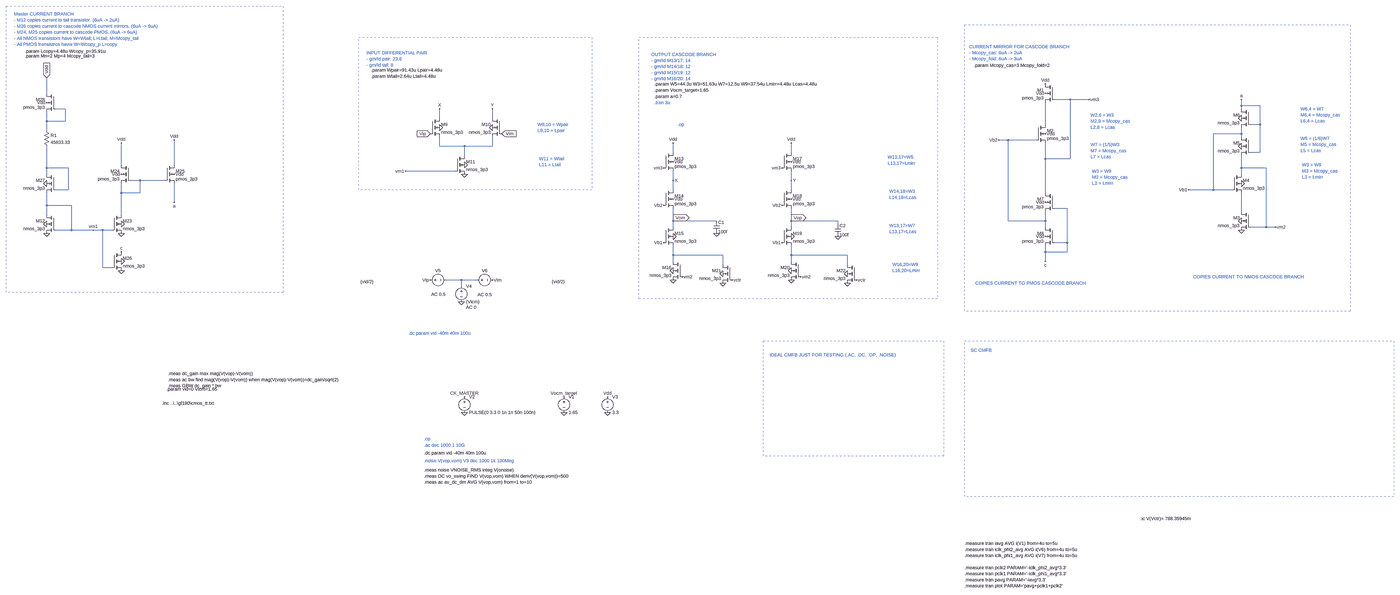
[diagram p0: schematic Draft15.asc, whole sheet]
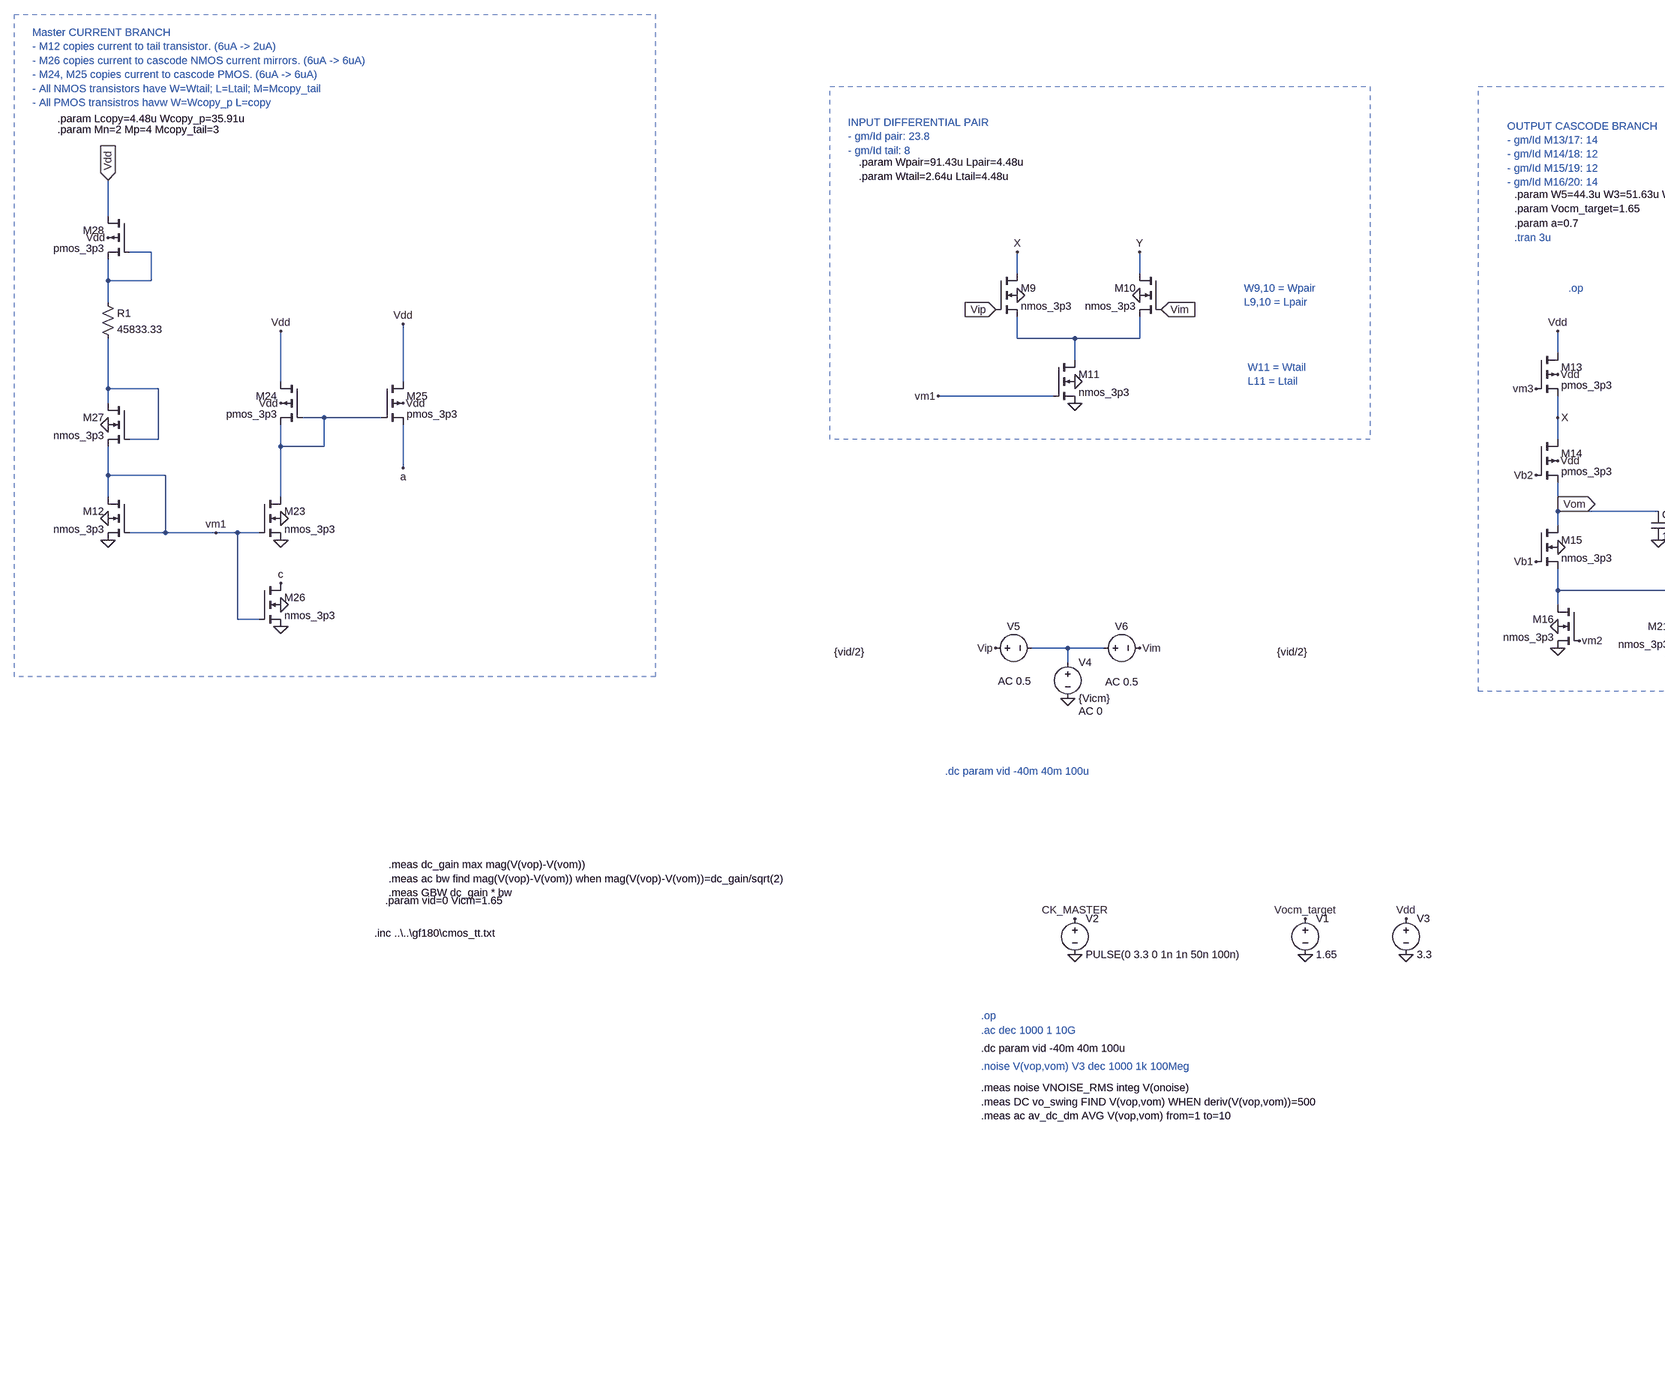
[diagram p1: schematic Draft15.asc, part, row 1 of 1, column 1 of 2]
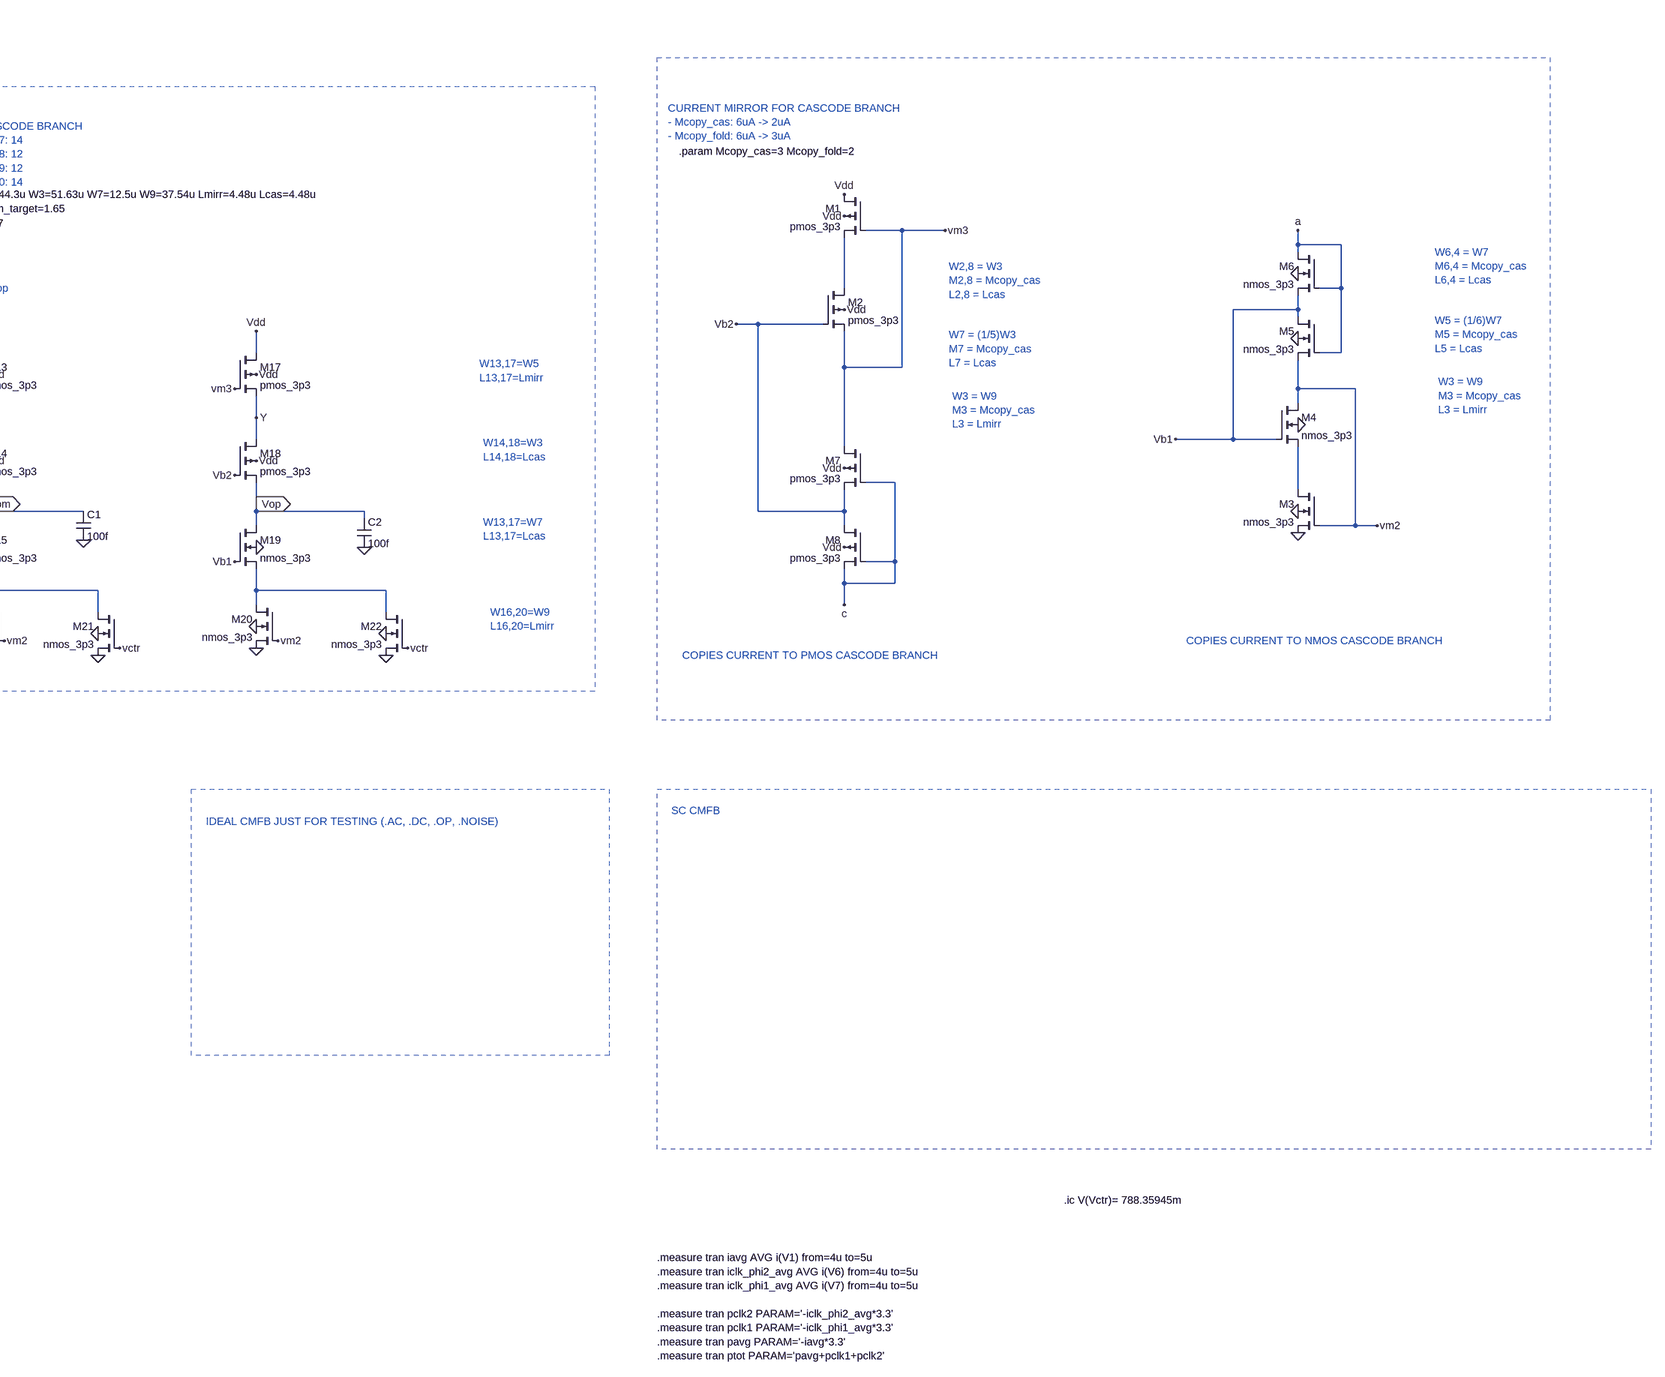
[diagram p2: schematic Draft15.asc, part, row 1 of 1, column 2 of 2]
Draft15.asc, the LTspice schematic file:
Version 4
SHEET 1 3844 1892
WIRE -3600 -688 -3600 -768
WIRE 2176 -656 2096 -656
WIRE 2272 -656 2176 -656
WIRE 3056 -624 3056 -656
WIRE 3152 -624 3056 -624
WIRE -3504 -608 -3552 -608
WIRE 3056 -608 3056 -624
WIRE -1536 -560 -1536 -608
WIRE -1264 -560 -1264 -608
WIRE -3600 -544 -3600 -592
WIRE -3504 -544 -3504 -608
WIRE -3504 -544 -3600 -544
WIRE 2048 -528 2048 -640
WIRE 3152 -528 3152 -624
WIRE 3152 -528 3104 -528
WIRE -3600 -496 -3600 -544
WIRE 3056 -480 3056 -512
WIRE 3056 -480 2912 -480
WIRE 3056 -464 3056 -480
WIRE 1856 -448 1808 -448
WIRE 2000 -448 1856 -448
WIRE -1536 -416 -1536 -464
WIRE -1408 -416 -1536 -416
WIRE -1264 -416 -1264 -464
WIRE -1264 -416 -1408 -416
WIRE -320 -384 -320 -432
WIRE 288 -384 288 -432
WIRE 3152 -384 3152 -528
WIRE 3152 -384 3104 -384
WIRE -1408 -368 -1408 -416
WIRE 2048 -352 2048 -432
WIRE 2176 -352 2176 -656
WIRE 2176 -352 2048 -352
WIRE -3216 -320 -3216 -432
WIRE -2944 -320 -2944 -448
WIRE -3600 -304 -3600 -416
WIRE -3488 -304 -3600 -304
WIRE 3056 -304 3056 -368
WIRE 3184 -304 3056 -304
WIRE -1456 -288 -1712 -288
WIRE -3600 -272 -3600 -304
WIRE 3056 -272 3056 -304
WIRE -3120 -240 -3168 -240
WIRE -2992 -240 -3120 -240
WIRE -320 -240 -320 -288
WIRE 288 -240 288 -288
WIRE -3488 -192 -3488 -304
WIRE -3488 -192 -3552 -192
WIRE -320 -192 -320 -240
WIRE 288 -192 288 -240
WIRE 2912 -192 2912 -480
WIRE 2912 -192 2784 -192
WIRE 3008 -192 2912 -192
WIRE -3216 -176 -3216 -224
WIRE -3120 -176 -3120 -240
WIRE -3120 -176 -3216 -176
WIRE 2048 -176 2048 -352
WIRE -2944 -128 -2944 -224
WIRE -3600 -112 -3600 -176
WIRE -3472 -112 -3600 -112
WIRE 2160 -96 2096 -96
WIRE 3056 -80 3056 -176
WIRE -3600 -64 -3600 -112
WIRE -3216 -64 -3216 -176
WIRE -320 -48 -320 -96
WIRE 288 -48 288 -96
WIRE -320 -32 -320 -48
WIRE -96 -32 -320 -32
WIRE 288 -32 288 -48
WIRE 528 -32 288 -32
WIRE 1856 -32 1856 -448
WIRE 2048 -32 2048 -80
WIRE 2048 -32 1856 -32
WIRE 528 -16 528 -32
WIRE -320 0 -320 -32
WIRE 288 0 288 -32
WIRE 2048 0 2048 -32
WIRE 3184 0 3184 -304
WIRE 3184 0 3104 0
WIRE 3232 0 3184 0
WIRE -3472 16 -3472 -112
WIRE -3472 16 -3552 16
WIRE -3360 16 -3472 16
WIRE -3312 16 -3360 16
WIRE -3264 16 -3312 16
WIRE 2160 80 2160 -96
WIRE 2160 80 2096 80
WIRE 2048 128 2048 96
WIRE 2160 128 2160 80
WIRE 2160 128 2048 128
WIRE -320 144 -320 96
WIRE -64 144 -320 144
WIRE 288 144 288 96
WIRE 576 144 288 144
WIRE -320 176 -320 144
WIRE 288 176 288 144
WIRE 2048 176 2048 128
WIRE -64 192 -64 144
WIRE 576 192 576 144
WIRE -3312 208 -3312 16
WIRE -3264 208 -3312 208
WIRE -1424 272 -1504 272
WIRE -1344 272 -1424 272
WIRE -1424 304 -1424 272
FLAG 2048 -688 Vdd
FLAG 2048 -736 Vdd
FLAG 2048 -480 Vdd
FLAG 2272 -656 vm3
FLAG 1808 -448 Vb2
FLAG 2048 176 c
FLAG 3056 16 0
FLAG 3056 -32 0
FLAG 3232 0 vm2
FLAG 3056 -224 0
FLAG 2784 -192 Vb1
FLAG 3056 -656 a
FLAG 3056 -416 0
FLAG 3056 -560 0
FLAG 2048 -128 Vdd
FLAG 2048 48 Vdd
FLAG -1408 -272 0
FLAG -1536 -512 0
FLAG -1264 -512 0
FLAG -1408 -320 0
FLAG -3600 32 0
FLAG -3600 -16 0
FLAG -1584 -480 Vip
IOPIN -1584 -480 In
FLAG -1216 -480 Vim
IOPIN -1216 -480 In
FLAG -320 -432 Vdd
FLAG -320 272 0
FLAG -320 224 0
FLAG -320 48 0
FLAG -320 -240 X
FLAG -320 -144 Vdd
FLAG -368 80 Vb1
FLAG -368 -112 Vb2
FLAG -320 -336 Vdd
FLAG 288 -432 Vdd
FLAG 288 272 0
FLAG 288 224 0
FLAG 288 48 0
FLAG 288 -240 Y
FLAG 288 -144 Vdd
FLAG 240 80 Vb1
FLAG 240 -112 Vb2
FLAG 288 -336 Vdd
FLAG 336 256 vm2
FLAG -272 256 vm2
FLAG 240 -304 vm3
FLAG -368 -304 vm3
FLAG 288 -48 Vop
IOPIN 288 -48 Out
FLAG -320 -48 Vom
IOPIN -320 -48 Out
FLAG -1536 -608 X
FLAG -1264 -608 Y
FLAG -3360 16 vm1
FLAG -64 288 0
FLAG -64 240 0
FLAG -16 272 vctr
FLAG 576 288 0
FLAG 576 240 0
FLAG 624 272 vctr
FLAG -96 32 0
FLAG 528 48 0
FLAG -1712 -288 vm1
FLAG -3216 32 0
FLAG -3216 -16 0
FLAG -3216 -272 Vdd
FLAG -3216 -432 Vdd
FLAG -2944 -272 Vdd
FLAG -2944 -448 Vdd
FLAG -2944 -128 a
FLAG -3216 224 0
FLAG -3216 176 0
FLAG -3216 128 c
FLAG -3600 -768 Vdd
IOPIN -3600 -768 In
FLAG -3600 -224 0
FLAG -3600 -640 Vdd
FLAG -896 960 0
FLAG -1408 960 0
FLAG -1408 880 CK_MASTER
FLAG -672 960 0
FLAG -672 880 Vdd
FLAG -1424 384 0
FLAG -1584 272 Vip
FLAG -1264 272 Vim
FLAG -896 880 Vocm_target
DATAFLAG -1552 -288 ""
DATAFLAG 1904 -448 ""
DATAFLAG 2160 -656 ""
DATAFLAG 2864 -192 ""
DATAFLAG 3168 0 ""
DATAFLAG -224 -32 ""
DATAFLAG -1392 -416 ""
DATAFLAG -160 144 ""
DATAFLAG 160 -16 "Id(M18)"
DATAFLAG 144 -336 "Id(M17)"
DATAFLAG -1248 -320 "Id(M11)"
DATAFLAG -1664 -592 "Id(M9)"
DATAFLAG -1168 -608 "Id(M9)"
DATAFLAG -240 -224 "V(X)"
DATAFLAG 160 176 "Id(M20)"
DATAFLAG 688 176 "Id(M22)"
DATAFLAG -3472 -32 ""
DATAFLAG -2944 -160 "Id(M25)"
DATAFLAG -3216 96 "Id(M26)"
DATAFLAG 3056 -688 "Id(M6)"
DATAFLAG 2048 224 "Id(M6)"
DATAFLAG -240 256 ""
SYMBOL pmos4 2096 -736 M0
SYMATTR InstName M1
SYMATTR Value pmos_3p3
SYMATTR Value2 l='Lmirr' w='W5' m=Mcopy_fold
SYMBOL pmos4 2000 -528 R0
SYMATTR InstName M2
SYMATTR Value pmos_3p3
SYMATTR Value2 l='Lcas' w='W3' m=Mcopy_cas
SYMBOL nmos4 3104 -80 M0
SYMATTR InstName M3
SYMATTR Value nmos_3p3
SYMATTR Value2 l='Lmirr' w='W9' m=Mcopy_cas
SYMBOL nmos4 3008 -272 R0
SYMATTR InstName M4
SYMATTR Value nmos_3p3
SYMATTR Value2 l='Lcas' w='W7' m=Mcopy_cas
SYMBOL nmos4 3104 -464 M0
SYMATTR InstName M5
SYMATTR Value nmos_3p3
SYMATTR Value2 l='Lcas' w='(1/6)*W7' m=Mcopy_cas
SYMBOL nmos4 3104 -608 M0
SYMATTR InstName M6
SYMATTR Value nmos_3p3
SYMATTR Value2 l='Lcas' w='W7' m=Mcopy_cas
SYMBOL pmos4 2096 -176 M0
SYMATTR InstName M7
SYMATTR Value pmos_3p3
SYMATTR Value2 l='Lcas' w='(1/5)*W3' m=Mcopy_cas
SYMBOL pmos4 2096 0 M0
SYMATTR InstName M8
SYMATTR Value pmos_3p3
SYMATTR Value2 l='Lcas' w='W3' m=Mcopy_cas
SYMBOL nmos4 -1584 -560 R0
SYMATTR InstName M9
SYMATTR Value nmos_3p3
SYMATTR Value2 l='Lpair' w='Wpair' m=3
SYMBOL nmos4 -1216 -560 M0
SYMATTR InstName M10
SYMATTR Value nmos_3p3
SYMATTR Value2 l='Lpair' w='Wpair' m=3
SYMBOL nmos4 -1456 -368 R0
SYMATTR InstName M11
SYMATTR Value nmos_3p3
SYMATTR Value2 l='Ltail' w='Wtail' m=1
SYMBOL nmos4 -3552 -64 M0
SYMATTR InstName M12
SYMATTR Value nmos_3p3
SYMATTR Value2 l='Ltail' w='Wtail' m=Mcopy_tail
SYMBOL pmos4 -368 -384 R0
SYMATTR InstName M13
SYMATTR Value pmos_3p3
SYMATTR Value2 l='Lmirr' w='W5' m=1
SYMBOL pmos4 -368 -192 R0
SYMATTR InstName M14
SYMATTR Value pmos_3p3
SYMATTR Value2 l='Lcas' w='W3' m=1
SYMBOL nmos4 -368 0 R0
SYMATTR InstName M15
SYMATTR Value nmos_3p3
SYMATTR Value2 l='Lcas' w='W7'
SYMBOL nmos4 -272 176 M0
SYMATTR InstName M16
SYMATTR Value nmos_3p3
SYMATTR Value2 l='Lmirr' w='a*W9'
SYMBOL pmos4 240 -384 R0
SYMATTR InstName M17
SYMATTR Value pmos_3p3
SYMATTR Value2 l='Lmirr' w='W5' m=1
SYMBOL pmos4 240 -192 R0
SYMATTR InstName M18
SYMATTR Value pmos_3p3
SYMATTR Value2 l='Lcas' w='W3' m=1
SYMBOL nmos4 240 0 R0
SYMATTR InstName M19
SYMATTR Value nmos_3p3
SYMATTR Value2 l='Lcas' w='W7'
SYMBOL nmos4 336 176 M0
SYMATTR InstName M20
SYMATTR Value nmos_3p3
SYMATTR Value2 l='Lmirr' w='a*W9'
SYMBOL nmos4 -16 192 M0
SYMATTR InstName M21
SYMATTR Value nmos_3p3
SYMATTR Value2 l='Lmirr' w='(1-a)*W9'
SYMBOL nmos4 624 192 M0
SYMATTR InstName M22
SYMATTR Value nmos_3p3
SYMATTR Value2 l='Lmirr' w='(1-a)*W9'
SYMBOL cap -112 -32 R0
SYMATTR InstName C1
SYMATTR Value 100f
SYMBOL cap 512 -16 R0
SYMATTR InstName C2
SYMATTR Value 100f
SYMBOL nmos4 -3264 -64 R0
SYMATTR InstName M23
SYMATTR Value nmos_3p3
SYMATTR Value2 l='Ltail' w='Wtail' m=Mcopy_tail
SYMBOL pmos4 -3168 -320 M0
SYMATTR InstName M24
SYMATTR Value pmos_3p3
SYMATTR Value2 l='Lcopy' w='Wcopy_p'
SYMBOL pmos4 -2992 -320 R0
SYMATTR InstName M25
SYMATTR Value pmos_3p3
SYMATTR Value2 l='Lcopy' w='Wcopy_p'
SYMBOL nmos4 -3264 128 R0
SYMATTR InstName M26
SYMATTR Value nmos_3p3
SYMATTR Value2 l='Ltail' w='Wtail' m=Mcopy_tail
SYMBOL nmos4 -3552 -272 M0
SYMATTR InstName M27
SYMATTR Value nmos_3p3
SYMATTR Value2 l='Ltail' w=2.64u m=3
SYMBOL pmos4 -3552 -688 M0
SYMATTR InstName M28
SYMATTR Value pmos_3p3
SYMATTR Value2 l='Ltail' w='Wcopy_p'
SYMBOL res -3616 -512 R0
SYMATTR InstName R1
SYMATTR Value 45833.33
SYMBOL voltage -896 864 R0
WINDOW 123 0 0 Left 0
WINDOW 39 0 0 Left 0
SYMATTR InstName V1
SYMATTR Value 1.65
SYMBOL voltage -1408 864 R0
WINDOW 123 0 0 Left 0
WINDOW 39 0 0 Left 0
SYMATTR InstName V2
SYMATTR Value PULSE(0 3.3 0 1n 1n 50n 100n)
SYMBOL voltage -672 864 R0
WINDOW 123 24 124 Left 2
WINDOW 39 0 0 Left 0
SYMATTR InstName V3
SYMATTR Value 3.3
SYMBOL voltage -1424 288 R0
WINDOW 123 24 124 Left 2
WINDOW 39 0 0 Left 0
SYMATTR Value2 AC 0
SYMATTR InstName V4
SYMATTR Value {Vicm}
SYMBOL voltage -1600 272 R270
WINDOW 0 32 56 VTop 2
WINDOW 3 7 -309 VBottom 2
WINDOW 123 -58 58 VBottom 2
WINDOW 39 0 0 Left 0
SYMATTR InstName V5
SYMATTR Value {vid/2}
SYMATTR Value2 AC 0.5
SYMBOL voltage -1360 272 R270
WINDOW 0 32 56 VTop 2
WINDOW 3 7 435 VBottom 2
WINDOW 123 -60 56 VBottom 2
WINDOW 39 0 0 Left 0
SYMATTR InstName V6
SYMATTR Value {vid/2}
SYMATTR Value2 AC 0.5
TEXT -1888 -808 Left 2 !.param Wpair=91.43u Lpair=4.48u
TEXT -1888 -776 Left 2 !.param Wtail=2.64u Ltail=4.48u
TEXT -2984 840 Left 2 !.param vid=0 Vicm=1.65
TEXT -3008 912 Left 2 !.inc ..\\..\\gf180\\cmos_tt.txt
TEXT -296 -528 Left 2 ;.op
TEXT -416 -736 Left 2 !.param W5=44.3u W3=51.63u W7=12.5u W9=37.54u Lmirr=4.48u Lcas=4.48u
TEXT -416 -704 Left 2 !.param Vocm_target=1.65
TEXT -416 -640 Left 2 ;.tran 3u
TEXT -416 -672 Left 2 !.param a=0.7
TEXT -1616 1128 Left 2 ;.ac dec 1000 1 10G
TEXT -1616 1168 Left 2 !.dc param vid -40m 40m 100u
TEXT -2976 760 Left 2 !.meas dc_gain max mag(V(vop)-V(vom))\n.meas ac bw find mag(V(vop)-V(vom)) when mag(V(vop)-V(vom))=dc_gain/sqrt(2)\n.meas GBW dc_gain * bw
TEXT -3712 -904 Left 2 !.param Lcopy=4.48u Wcopy_p=35.91u
TEXT -3768 -1096 Left 2 ;Master CURRENT BRANCH\n- M12 copies current to tail transistor. (6uA -> 2uA)\n- M26 copies current to cascode NMOS current mirrors. (6uA -> 6uA)\n- M24, M25 copies current to cascode PMOS. (6uA -> 6uA)\n- All NMOS transistors have W=Wtail; L=Ltail; M=Mcopy_tail\n- All PMOS transistros havw W=Wcopy_p L=copy
TEXT -1912 -896 Left 2 ;INPUT DIFFERENTIAL PAIR\n- gm/Id pair: 23.8\n- gm/Id tail: 8
TEXT -1616 1208 Left 2 ;.noise V(vop,vom) V3 dec 1000 1k 100Meg
TEXT -1616 1256 Left 2 !.meas noise VNOISE_RMS integ V(onoise)\n.meas DC vo_swing FIND V(vop,vom) WHEN deriv(V(vop,vom))=500\n.meas ac av_dc_dm AVG V(vop,vom) from=1 to=10
TEXT -3712 -880 Left 2 !.param Mn=2 Mp=4 Mcopy_tail=3
TEXT 1680 -832 Left 2 !.param Mcopy_cas=3 Mcopy_fold=2
TEXT 1656 -928 Left 2 ;CURRENT MIRROR FOR CASCODE BRANCH\n- Mcopy_cas: 6uA -> 2uA\n- Mcopy_fold: 6uA -> 3uA
TEXT 1688 288 Left 2 ;COPIES CURRENT TO PMOS CASCODE BRANCH
TEXT 2808 256 Left 2 ;COPIES CURRENT TO NMOS CASCODE BRANCH
TEXT 1632 1680 Left 2 !.measure tran iavg AVG i(V1) from=4u to=5u\n.measure tran iclk_phi2_avg AVG i(V6) from=4u to=5u\n.measure tran iclk_phi1_avg AVG i(V7) from=4u to=5u\n \n.measure tran pclk2 PARAM='-iclk_phi2_avg*3.3'\n.measure tran pclk1 PARAM='-iclk_phi1_avg*3.3'\n.measure tran pavg PARAM='-iavg*3.3'\n.measure tran ptot PARAM='pavg+pclk1+pclk2'
TEXT -432 -888 Left 2 ;OUTPUT CASCODE BRANCH\n- gm/Id M13/17: 14\n- gm/Id M14/18: 12\n- gm/Id M15/19: 12\n- gm/Id M16/20: 14
TEXT 1664 640 Left 2 ;SC CMFB
TEXT 176 664 Left 2 ;IDEAL CMFB JUST FOR TESTING (.AC, .DC, .OP, .NOISE)
TEXT 784 -360 Left 2 ;W13,17=W5\nL13,17=Lmirr
TEXT 792 -184 Left 2 ;W14,18=W3\nL14,18=Lcas
TEXT 792 -8 Left 2 ;W13,17=W7\nL13,17=Lcas
TEXT 808 192 Left 2 ;W16,20=W9\nL16,20=Lmirr
TEXT 3360 -608 Left 2 ;W6,4 = W7\nM6,4 = Mcopy_cas\nL6,4 = Lcas
TEXT 3360 -456 Left 2 ;W5 = (1/6)W7\nM5 = Mcopy_cas\nL5 = Lcas
TEXT 3368 -320 Left 2 ;W3 = W9\nM3 = Mcopy_cas\nL3 = Lmirr
TEXT 2280 -576 Left 2 ;W2,8 = W3\nM2,8 = Mcopy_cas\nL2,8 = Lcas
TEXT 2280 -424 Left 2 ;W7 = (1/5)W3\nM7 = Mcopy_cas\nL7 = Lcas
TEXT 2288 -288 Left 2 ;W3 = W9\nM3 = Mcopy_cas\nL3 = Lmirr
TEXT -1032 -528 Left 2 ;W9,10 = Wpair\nL9,10 = Lpair
TEXT -1024 -352 Left 2 ;W11 = Wtail\nL11 = Ltail
TEXT -1616 1096 Left 2 ;.op
TEXT 2536 1536 Left 2 !.ic V(Vctr)= 788.35945m
TEXT -1696 552 Left 2 ;.dc param vid -40m 40m 100u
RECTANGLE Normal 1040 368 -496 -976 2
RECTANGLE Normal 3616 432 1632 -1040 2
RECTANGLE Normal 3840 1392 1632 592 2
RECTANGLE Normal -752 -192 -1952 -976 2
RECTANGLE Normal -2384 336 -3808 -1136 2
RECTANGLE Normal 1072 1184 144 592 2

The netlist it stands for:
* Draft15.asc
M1 Vdd vm3 N002 Vdd pmos_3p3 l='Lmirr' w='W5' m=Mcopy_fold
M2 N002 Vb2 vm3 Vdd pmos_3p3 l='Lcas' w='W3' m=Mcopy_cas
M3 N006 vm2 0 0 nmos_3p3 l='Lmirr' w='W9' m=Mcopy_cas
M4 vm2 Vb1 N006 0 nmos_3p3 l='Lcas' w='W7' m=Mcopy_cas
M5 Vb1 a vm2 0 nmos_3p3 l='Lcas' w='(1/6)*W7' m=Mcopy_cas
M6 a a Vb1 0 nmos_3p3 l='Lcas' w='W7' m=Mcopy_cas
M7 vm3 c Vb2 Vdd pmos_3p3 l='Lcas' w='(1/5)*W3' m=Mcopy_cas
M8 Vb2 c c Vdd pmos_3p3 l='Lcas' w='W3' m=Mcopy_cas
M9 X Vip N003 0 nmos_3p3 l='Lpair' w='Wpair' m=3
M10 Y Vim N003 0 nmos_3p3 l='Lpair' w='Wpair' m=3
M11 N003 vm1 0 0 nmos_3p3 l='Ltail' w='Wtail' m=1
M12 vm1 vm1 0 0 nmos_3p3 l='Ltail' w='Wtail' m=Mcopy_tail
M13 Vdd vm3 X Vdd pmos_3p3 l='Lmirr' w='W5' m=1
M14 X Vb2 Vom Vdd pmos_3p3 l='Lcas' w='W3' m=1
M15 Vom Vb1 N007 0 nmos_3p3 l='Lcas' w='W7'
M16 N007 vm2 0 0 nmos_3p3 l='Lmirr' w='a*W9'
M17 Vdd vm3 Y Vdd pmos_3p3 l='Lmirr' w='W5' m=1
M18 Y Vb2 Vop Vdd pmos_3p3 l='Lcas' w='W3' m=1
M19 Vop Vb1 N008 0 nmos_3p3 l='Lcas' w='W7'
M20 N008 vm2 0 0 nmos_3p3 l='Lmirr' w='a*W9'
M21 N007 vctr 0 0 nmos_3p3 l='Lmirr' w='(1-a)*W9'
M22 N008 vctr 0 0 nmos_3p3 l='Lmirr' w='(1-a)*W9'
C1 Vom 0 100f
C2 Vop 0 100f
M23 N005 vm1 0 0 nmos_3p3 l='Ltail' w='Wtail' m=Mcopy_tail
M24 Vdd N005 N005 Vdd pmos_3p3 l='Lcopy' w='Wcopy_p'
M25 Vdd N005 a Vdd pmos_3p3 l='Lcopy' w='Wcopy_p'
M26 c vm1 0 0 nmos_3p3 l='Ltail' w='Wtail' m=Mcopy_tail
M27 N004 N004 vm1 0 nmos_3p3 l='Ltail' w=2.64u m=3
M28 Vdd N001 N001 Vdd pmos_3p3 l='Ltail' w='Wcopy_p'
R1 N001 N004 45833.33
V1 Vocm_target 0 1.65
V2 CK_MASTER 0 PULSE(0 3.3 0 1n 1n 50n 100n)
V3 Vdd 0 3.3
V4 N009 0 {Vicm} AC 0
V5 Vip N009 {vid/2} AC 0.5
V6 N009 Vim {vid/2} AC 0.5
.model NMOS NMOS
.model PMOS PMOS
.lib standard.mos
.param Wpair=91.43u Lpair=4.48u
.param Wtail=2.64u Ltail=4.48u
.param vid=0 Vicm=1.65
.inc ..\..\gf180\cmos_tt.txt
* .op
.param W5=44.3u W3=51.63u W7=12.5u W9=37.54u Lmirr=4.48u Lcas=4.48u
.param Vocm_target=1.65
* .tran 3u
.param a=0.7
* .ac dec 1000 1 10G
.dc param vid -40m 40m 100u
.meas dc_gain max mag(V(vop)-V(vom))
.meas ac bw find mag(V(vop)-V(vom)) when mag(V(vop)-V(vom))=dc_gain/sqrt(2)
.meas GBW dc_gain * bw
.param Lcopy=4.48u Wcopy_p=35.91u
* Master CURRENT BRANCH
* - M12 copies current to tail transistor. (6uA -> 2uA)
* - M26 copies current to cascode NMOS current mirrors. (6uA -> 6uA)
* - M24, M25 copies current to cascode PMOS. (6uA -> 6uA)
* - All NMOS transistors have W=Wtail; L=Ltail; M=Mcopy_tail
* - All PMOS transistros havw W=Wcopy_p L=copy
* INPUT DIFFERENTIAL PAIR
* - gm/Id pair: 23.8
* - gm/Id tail: 8
* .noise V(vop,vom) V3 dec 1000 1k 100Meg
.meas noise VNOISE_RMS integ V(onoise)
.meas DC vo_swing FIND V(vop,vom) WHEN deriv(V(vop,vom))=500
.meas ac av_dc_dm AVG V(vop,vom) from=1 to=10
.param Mn=2 Mp=4 Mcopy_tail=3
.param Mcopy_cas=3 Mcopy_fold=2
* CURRENT MIRROR FOR CASCODE BRANCH
* - Mcopy_cas: 6uA -> 2uA
* - Mcopy_fold: 6uA -> 3uA
* COPIES CURRENT TO PMOS CASCODE BRANCH
* COPIES CURRENT TO NMOS CASCODE BRANCH
.measure tran iavg AVG i(V1) from=4u to=5u
.measure tran iclk_phi2_avg AVG i(V6) from=4u to=5u
.measure tran iclk_phi1_avg AVG i(V7) from=4u to=5u
.measure tran pclk2 PARAM='-iclk_phi2_avg*3.3'
.measure tran pclk1 PARAM='-iclk_phi1_avg*3.3'
.measure tran pavg PARAM='-iavg*3.3'
.measure tran ptot PARAM='pavg+pclk1+pclk2'
* OUTPUT CASCODE BRANCH
* - gm/Id M13/17: 14
* - gm/Id M14/18: 12
* - gm/Id M15/19: 12
* - gm/Id M16/20: 14
* SC CMFB
* IDEAL CMFB JUST FOR TESTING (.AC, .DC, .OP, .NOISE)
* W13,17=W5
* L13,17=Lmirr
* W14,18=W3
* L14,18=Lcas
* W13,17=W7
* L13,17=Lcas
* W16,20=W9
* L16,20=Lmirr
* W6,4 = W7
* M6,4 = Mcopy_cas
* L6,4 = Lcas
* W5 = (1/6)W7
* M5 = Mcopy_cas
* L5 = Lcas
* W3 = W9
* M3 = Mcopy_cas
* L3 = Lmirr
* W2,8 = W3
* M2,8 = Mcopy_cas
* L2,8 = Lcas
* W7 = (1/5)W3
* M7 = Mcopy_cas
* L7 = Lcas
* W3 = W9
* M3 = Mcopy_cas
* L3 = Lmirr
* W9,10 = Wpair
* L9,10 = Lpair
* W11 = Wtail
* L11 = Ltail
* .op
.ic V(Vctr)= 788.35945m
* .dc param vid -40m 40m 100u
.backanno
.end